# Altium project TDFN.PrjPcb
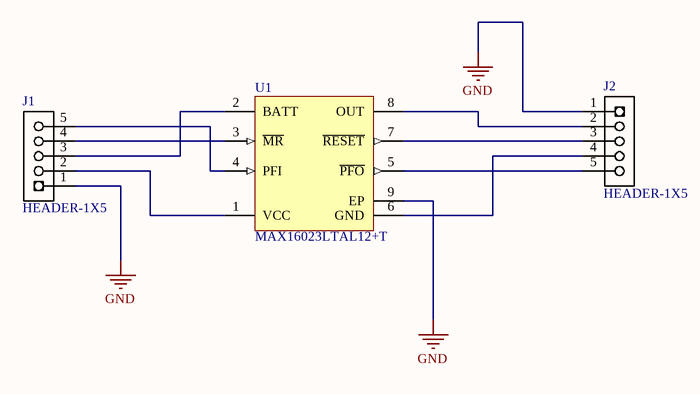
[diagram p0: Sheet1.SchDoc]
1 sheet, 3 parts. Net scope: global (net labels, ports and power ports of the same name join across sheets).
Board file: PCB1.PcbDoc

## Sheet Sheet1.SchDoc
size A4

### Parts
J1  HEADER-1X5  [HEADER-1X5]
J2  HEADER-1X5  [HEADER-1X5]
U1  MAX16023LTAL12+T  [T823+1_V]

### Nets
GND: J1.1 J2.1 U1.9(EP)
NetJ1_2: J1.2 U1.1(VCC)
NetJ1_3: J1.3 U1.2(BATT)
NetJ1_4: J1.4 U1.3(~{MR})
NetJ1_5: J1.5 U1.4(PFI)
NetJ2_2: J2.2 U1.8(OUT)
NetJ2_3: J2.3 U1.7(~{RESET})
NetJ2_4: J2.4 U1.6(GND)
NetJ2_5: J2.5 U1.5(~{PFO})

### Library data of the parts
J1 J2 = HEADER-1X5: PINHEADER 1X5; REEL: TH; Supplier 1: Digi-Key; Supplier Part Number 1: S1011E-36-ND
U1 = MAX16023LTAL12+T: Battery-Backup Circuit with Regulated Output Voltage, 1.2V; 1.8V, 2.5V, 3.0V, 3.3V output, 8-Pin TDFN, -40°C to +85°C, Pb-Free, Tape and Reel; DatasheetVersion: Rev 0, Aug-2008; PackageVersion: revJ, 2009; PackageReference: T833+2; PackageDescription: 8-Pin Plastic Very Very Thin Dual Flatpack No Leads, Exposed Pad, 3 x 3 x 0.8 mm Body, TDFN-EP, Pb-Free; Code_JEDEC: MO-229-WEEC; ComponentLink1Description: Manufacturer URL; ComponentLink1URL: http://www.maxim-ic.com; ComponentLink2Description: Datasheet; ComponentLink2URL: http://datasheets.maxim-ic.com/en/ds/MAX16023-MAX16024.pdf; ComponentLink3Description: Package Specification; ComponentLink3URL: http://pdfserv.maxim-ic.com/package_dwgs/21-0137.PDF